# EAGLE schematic PCA9615_Connection (EAGLE 8.7.1)
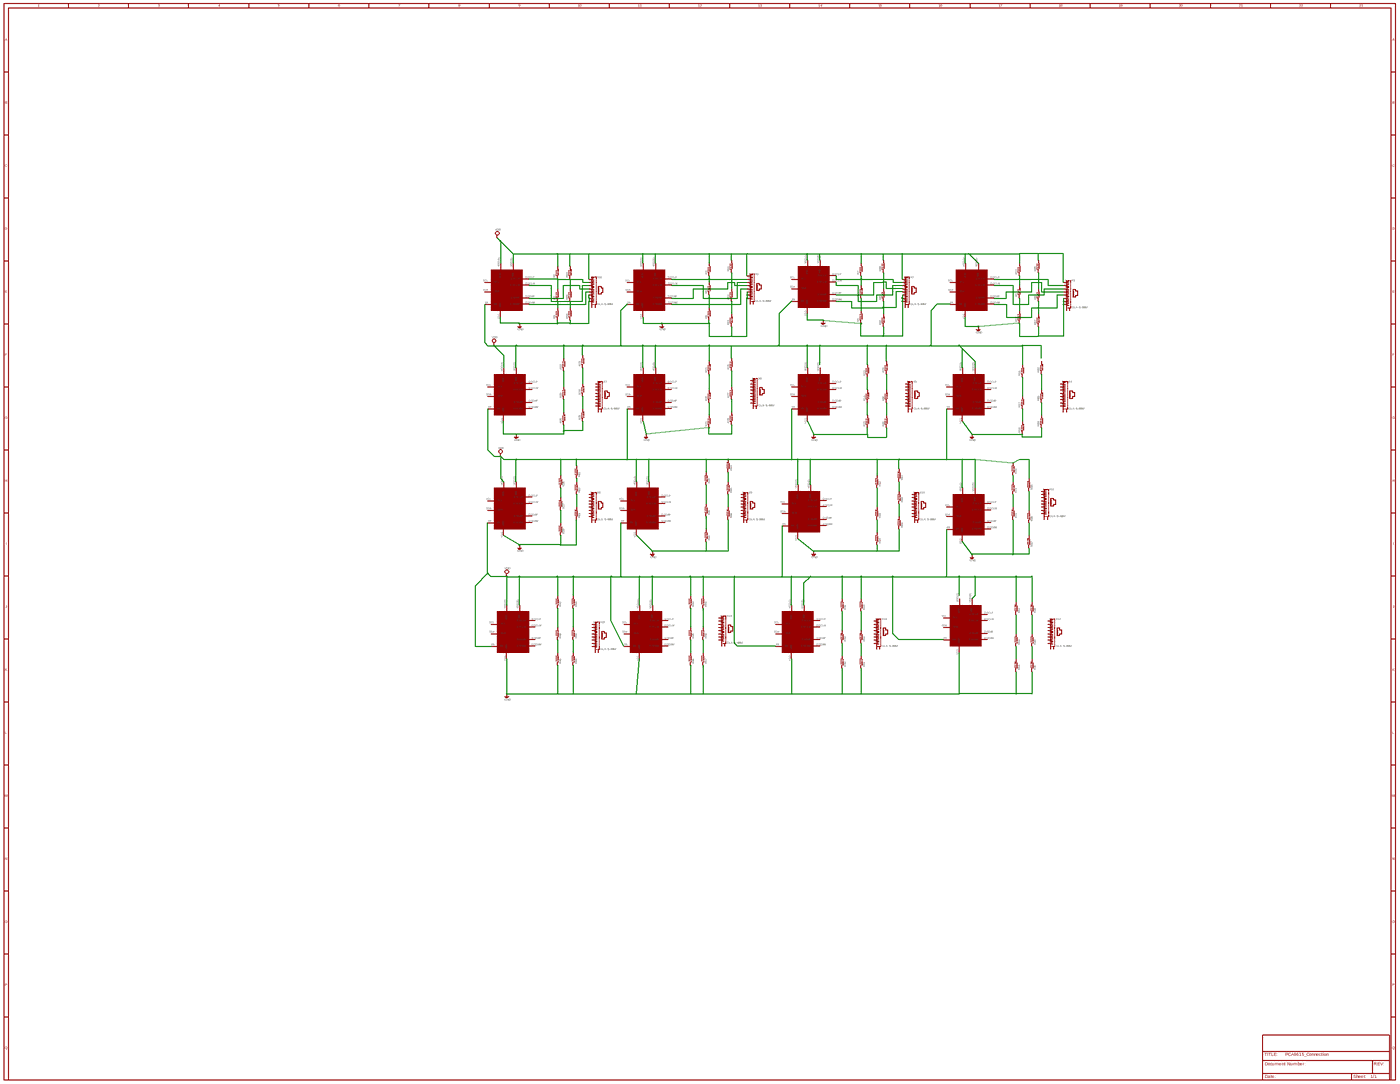
[diagram p0: schematic, sheet 1, overview]
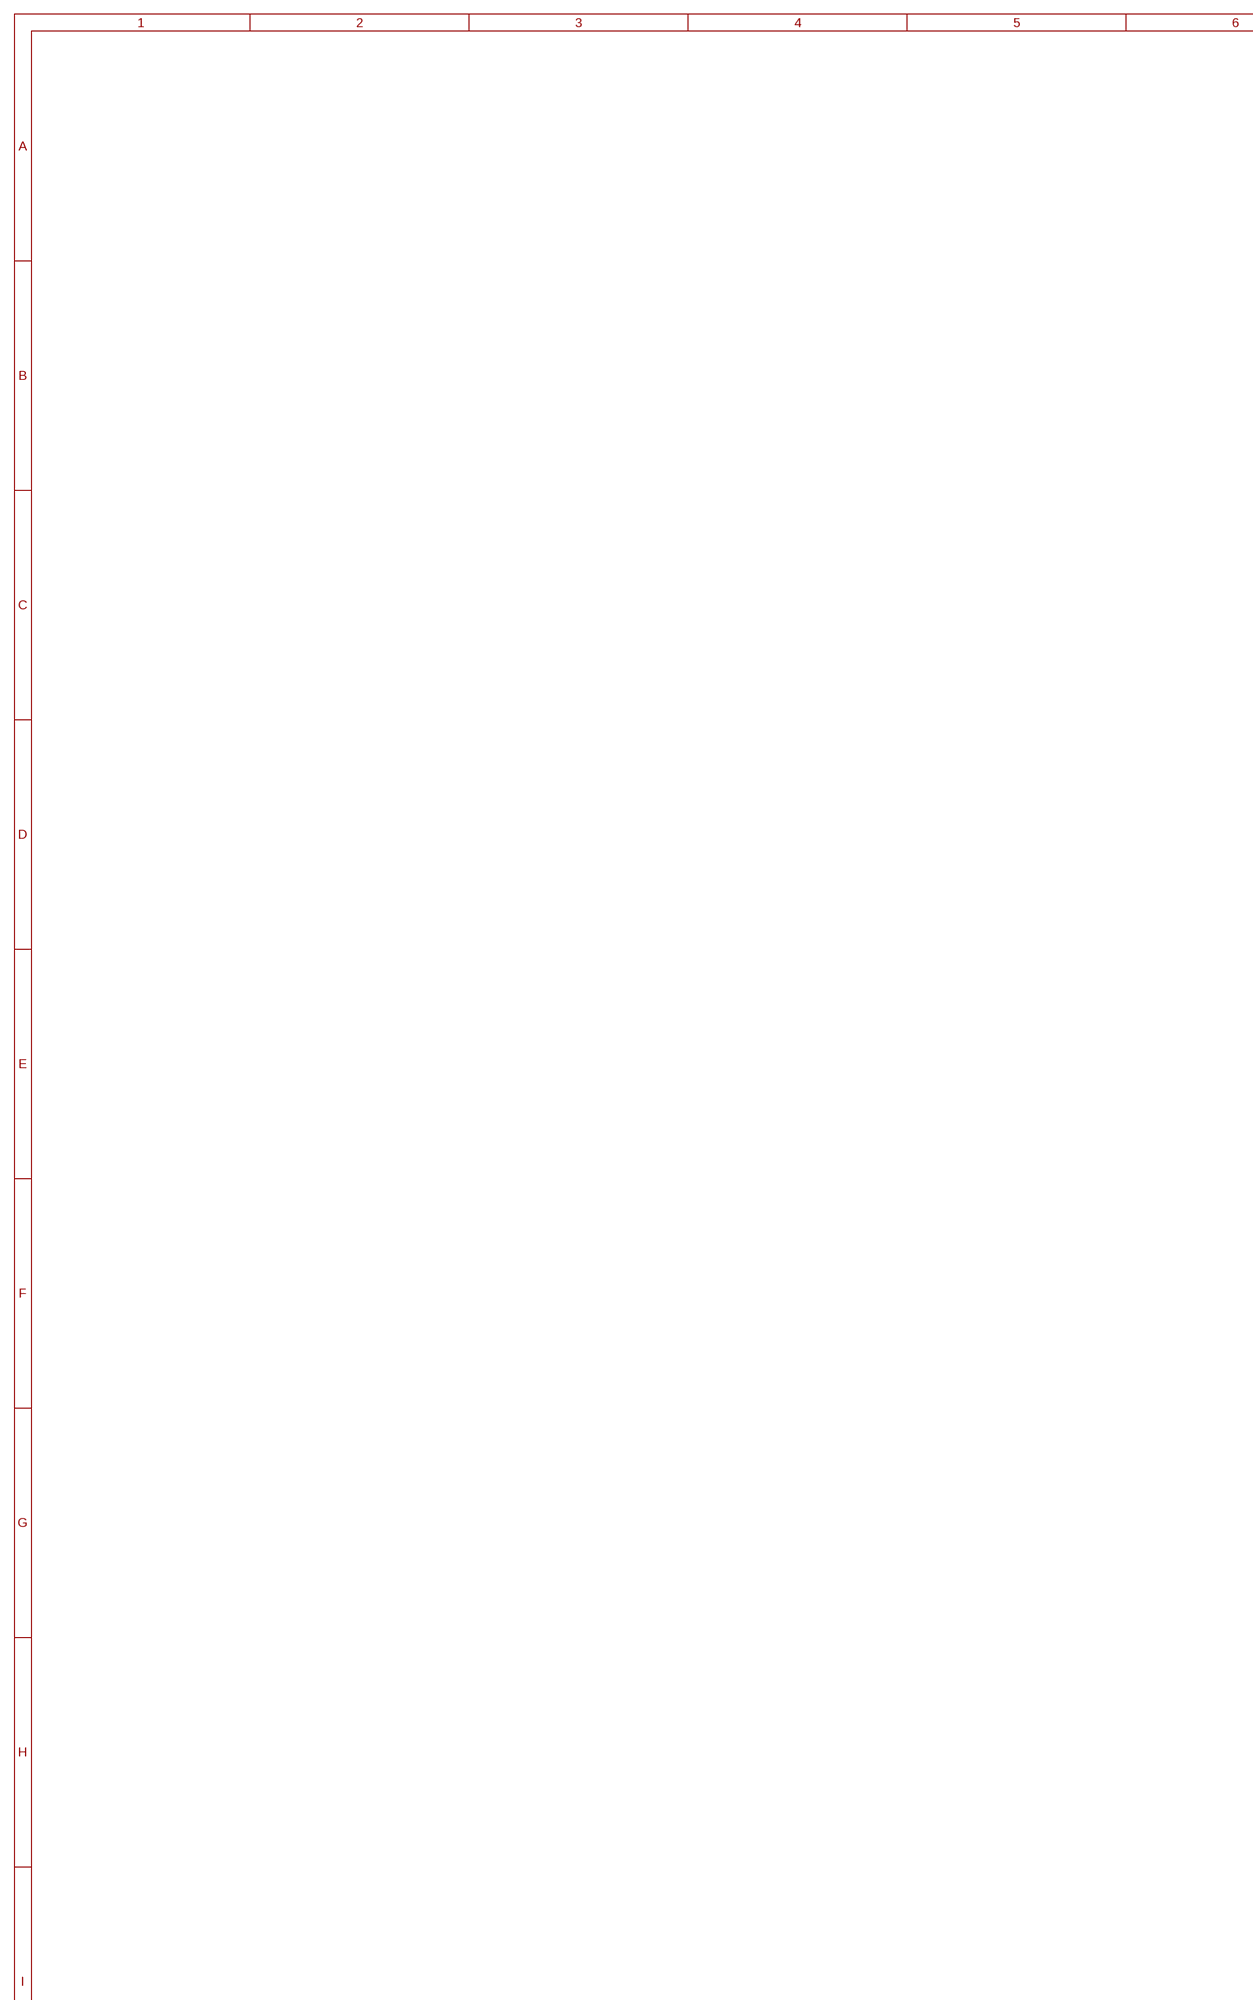
[diagram p1: schematic, sheet 1, part 1 of 8]
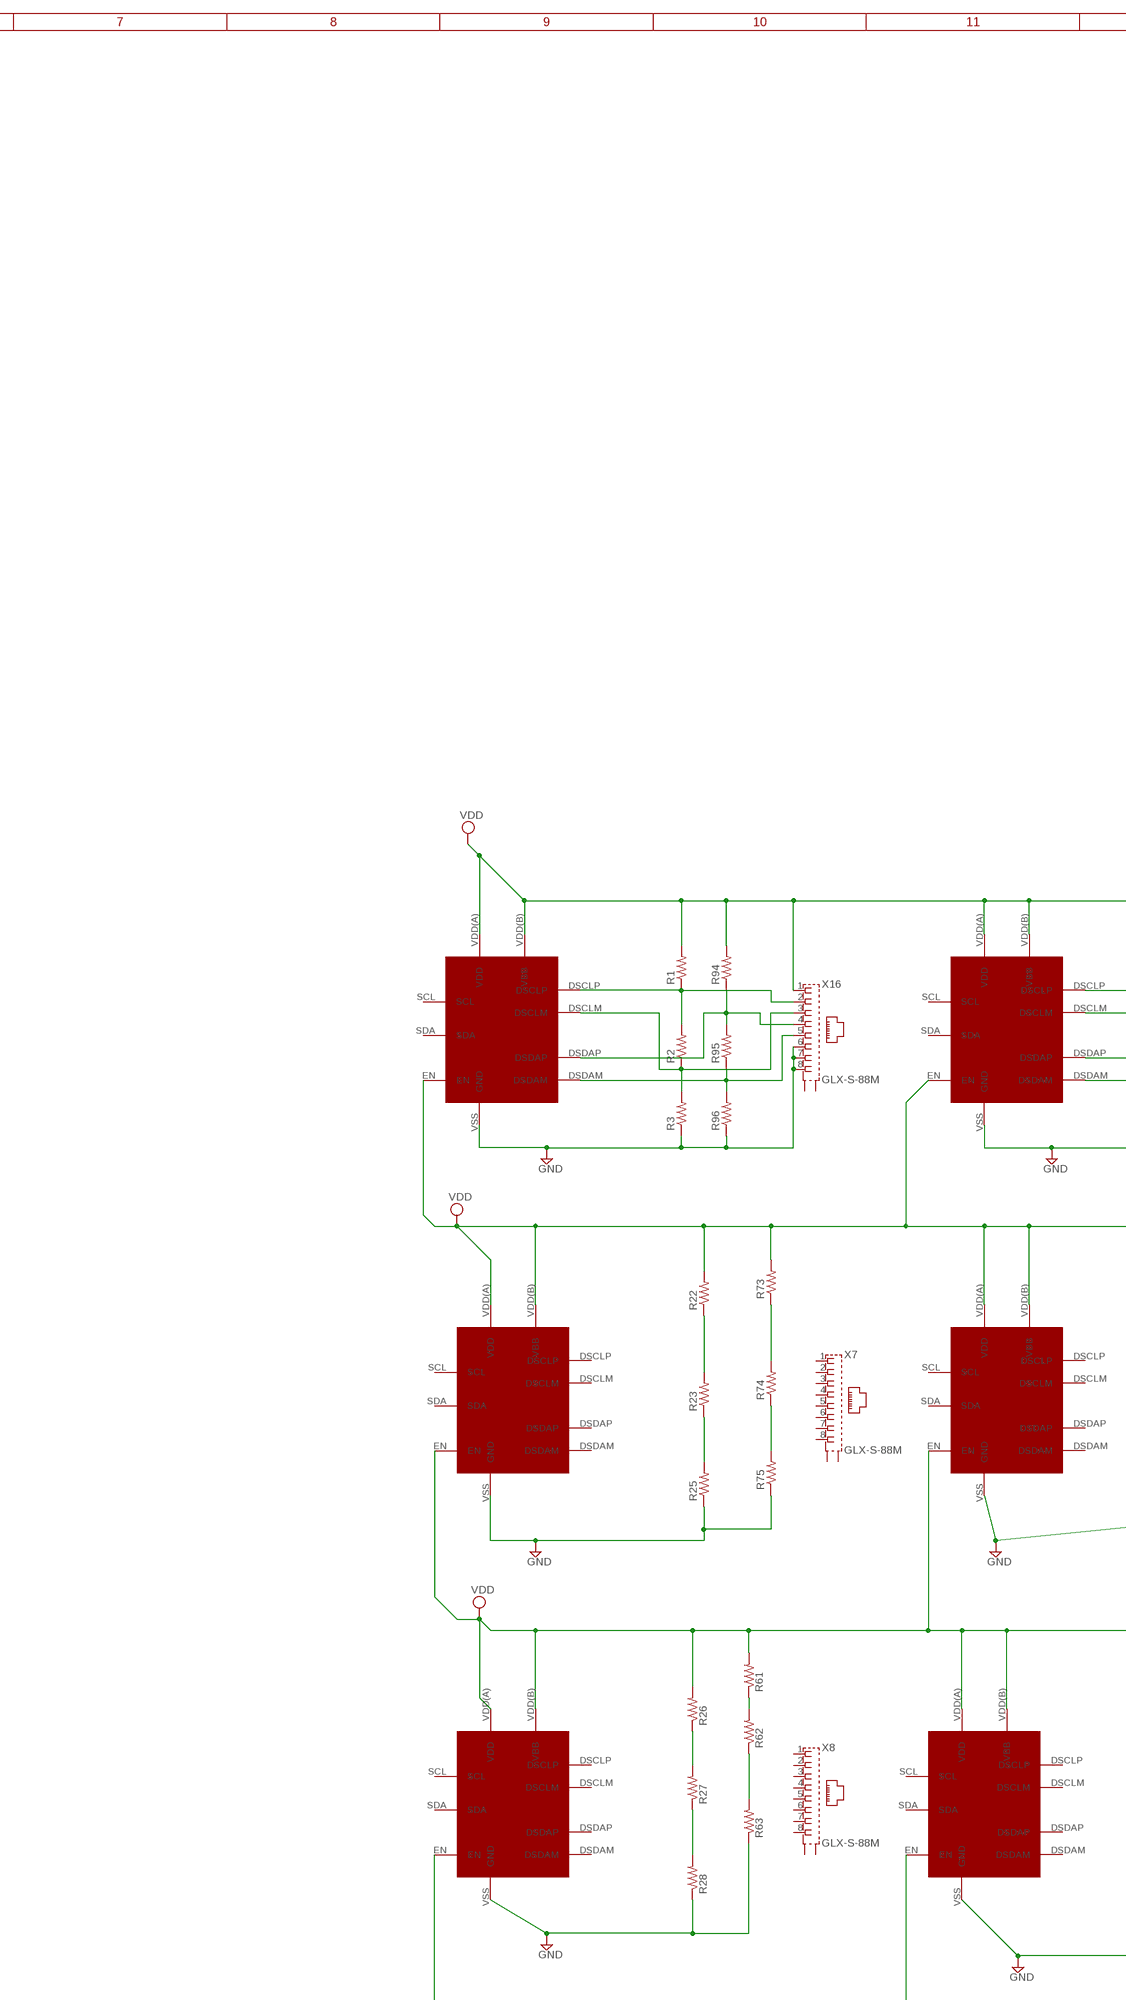
[diagram p2: schematic, sheet 1, part 2 of 8]
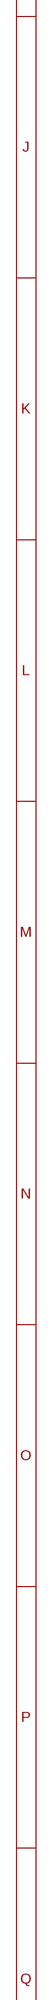
[diagram p3: schematic, sheet 1, part 3 of 8]
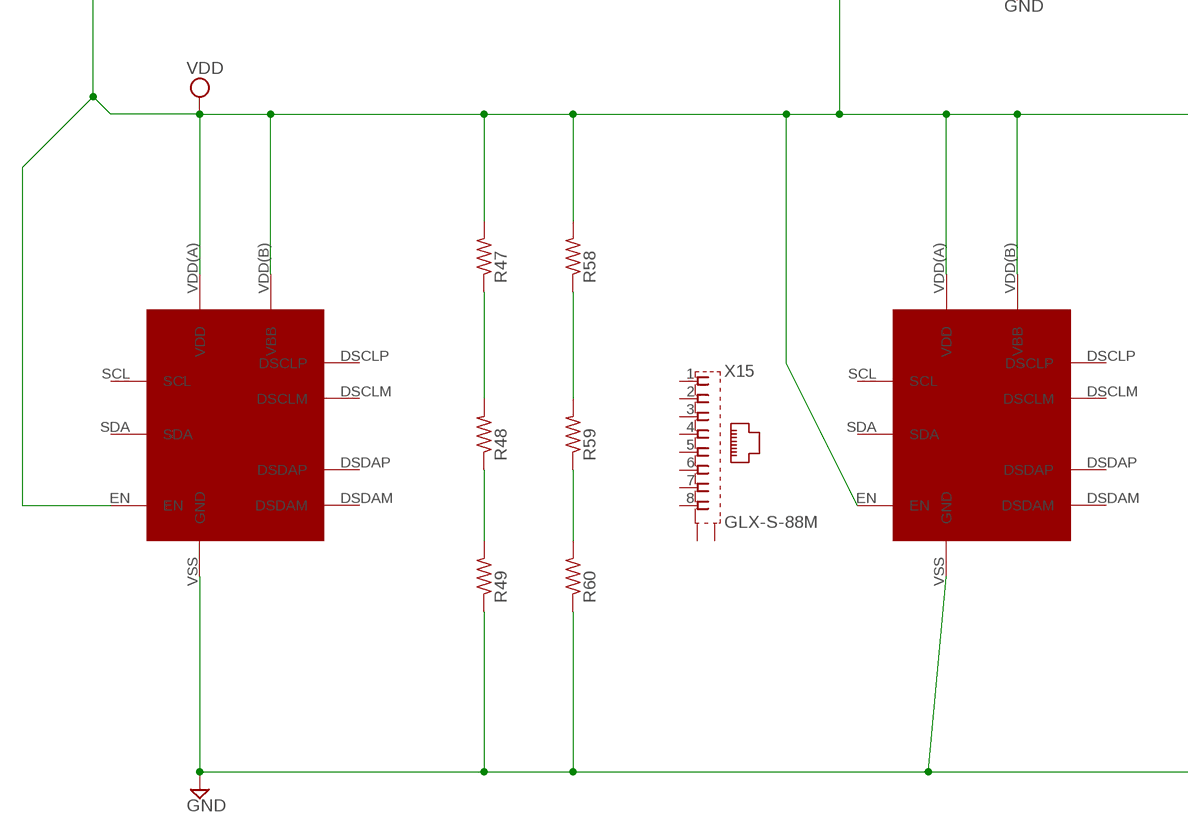
[diagram p4: schematic, sheet 1, part 4 of 8]
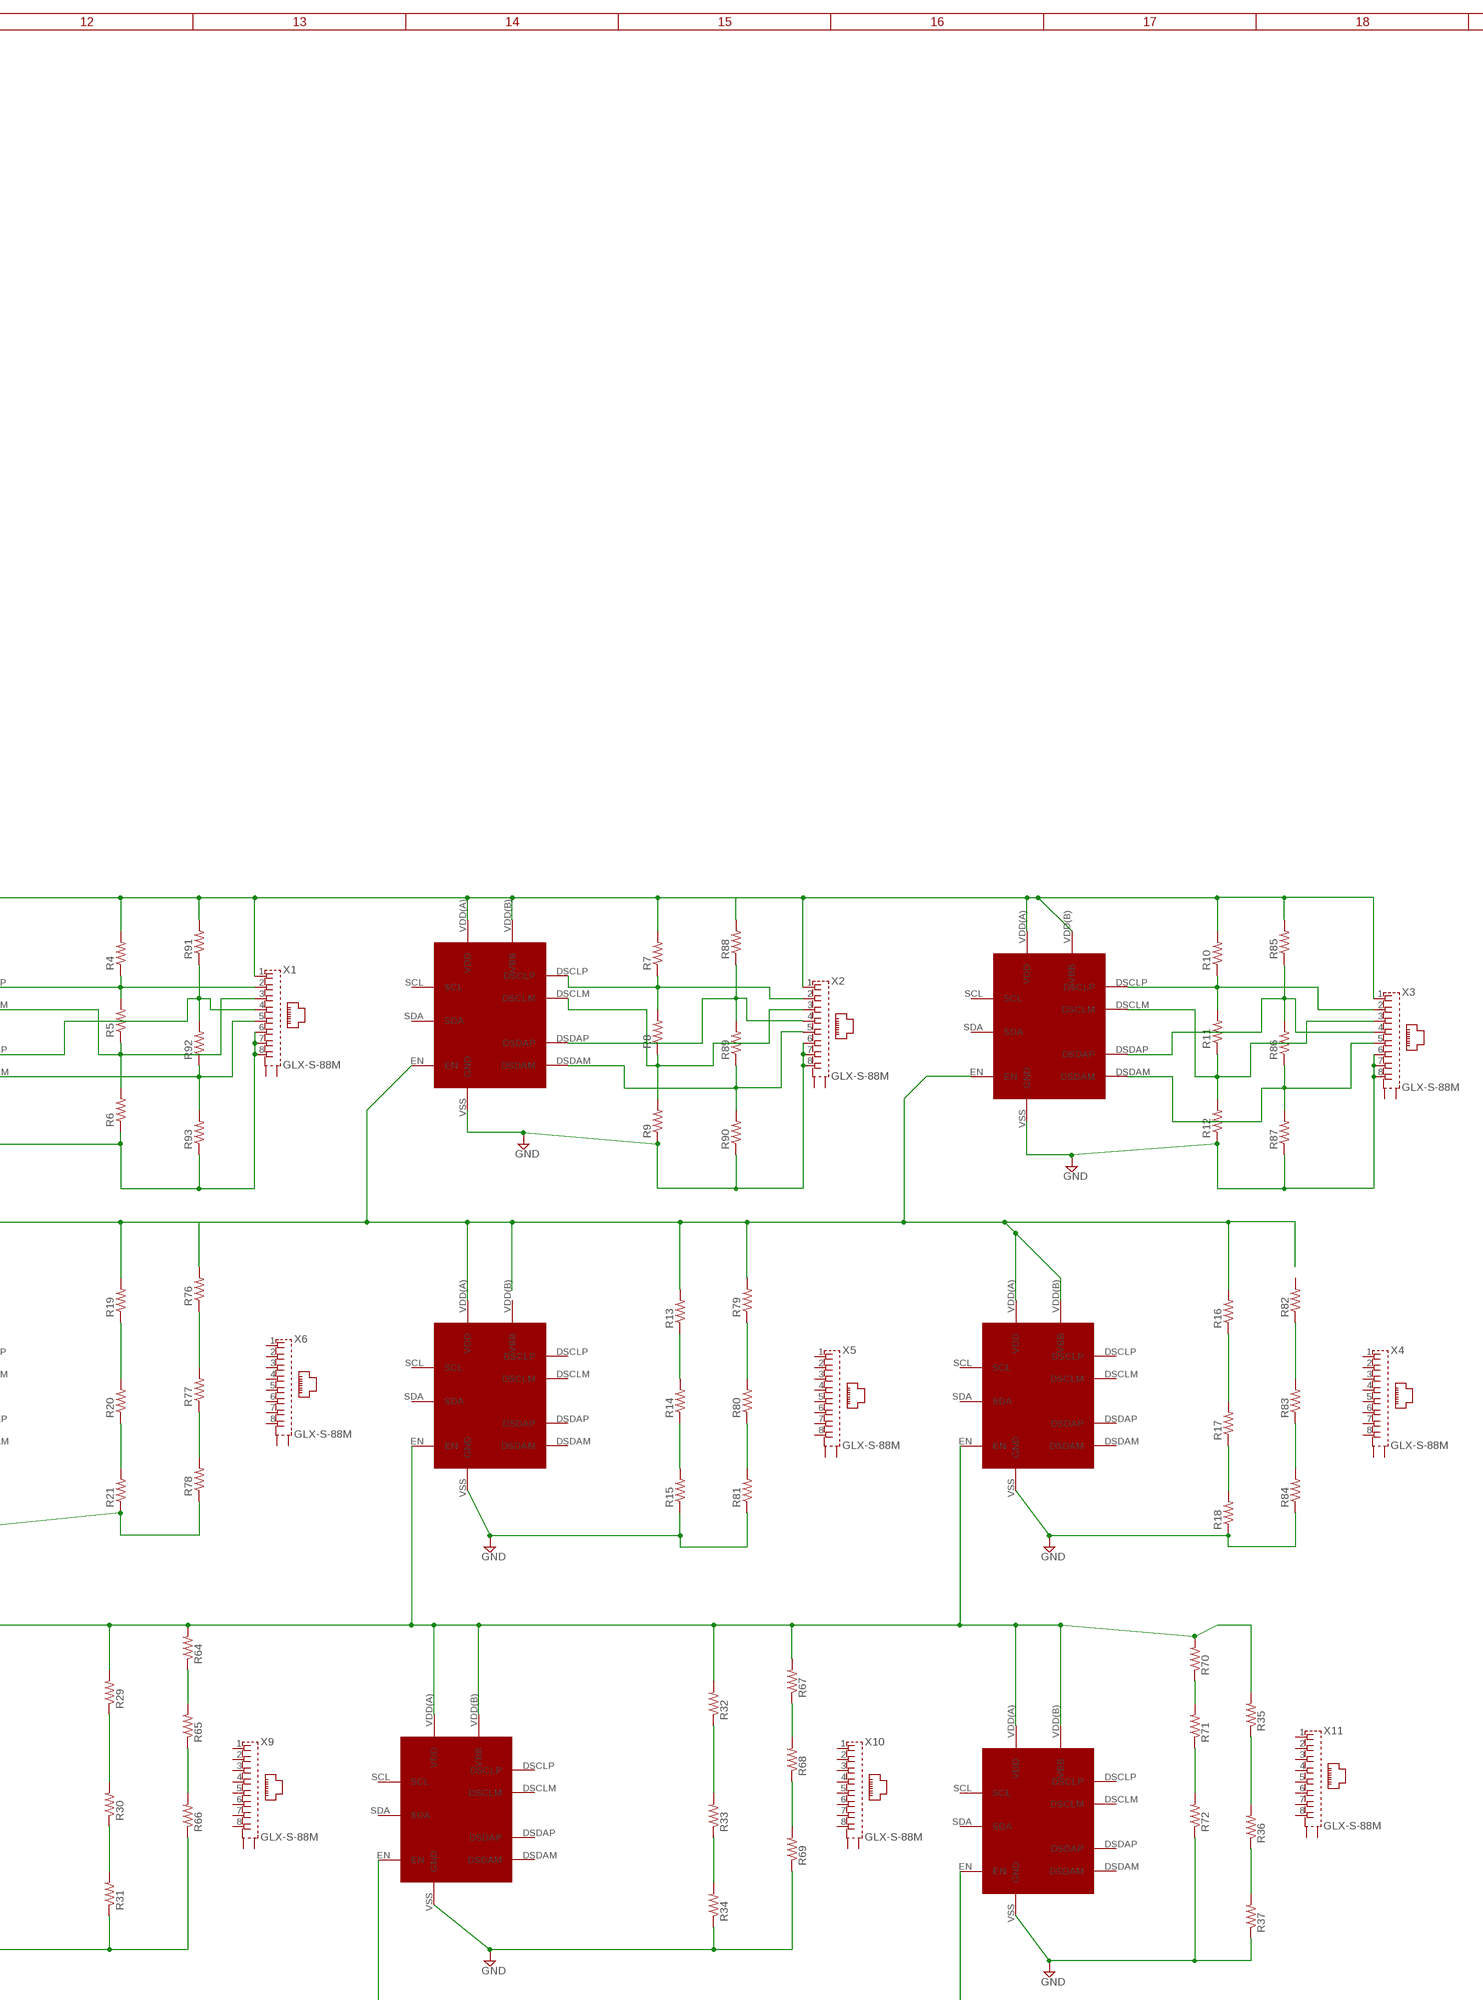
[diagram p5: schematic, sheet 1, part 5 of 8]
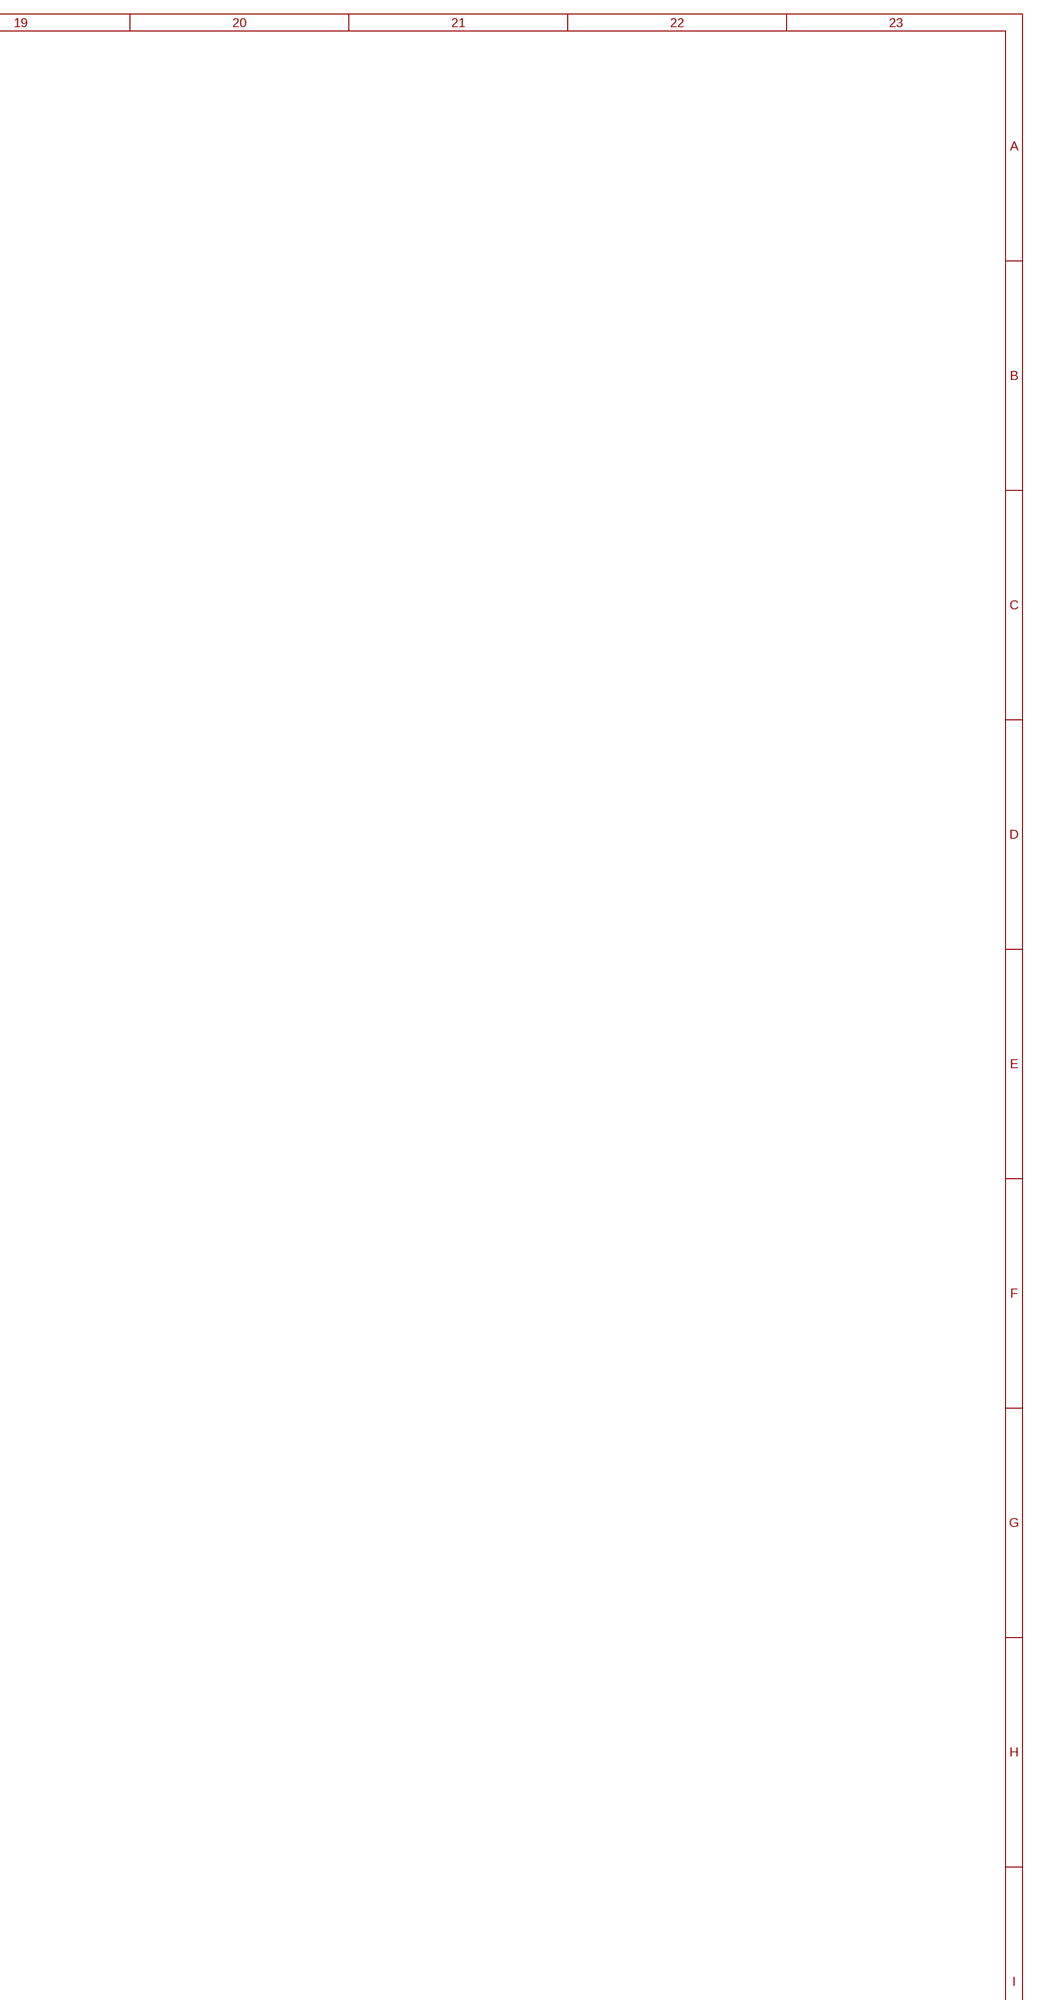
[diagram p6: schematic, sheet 1, part 6 of 8]
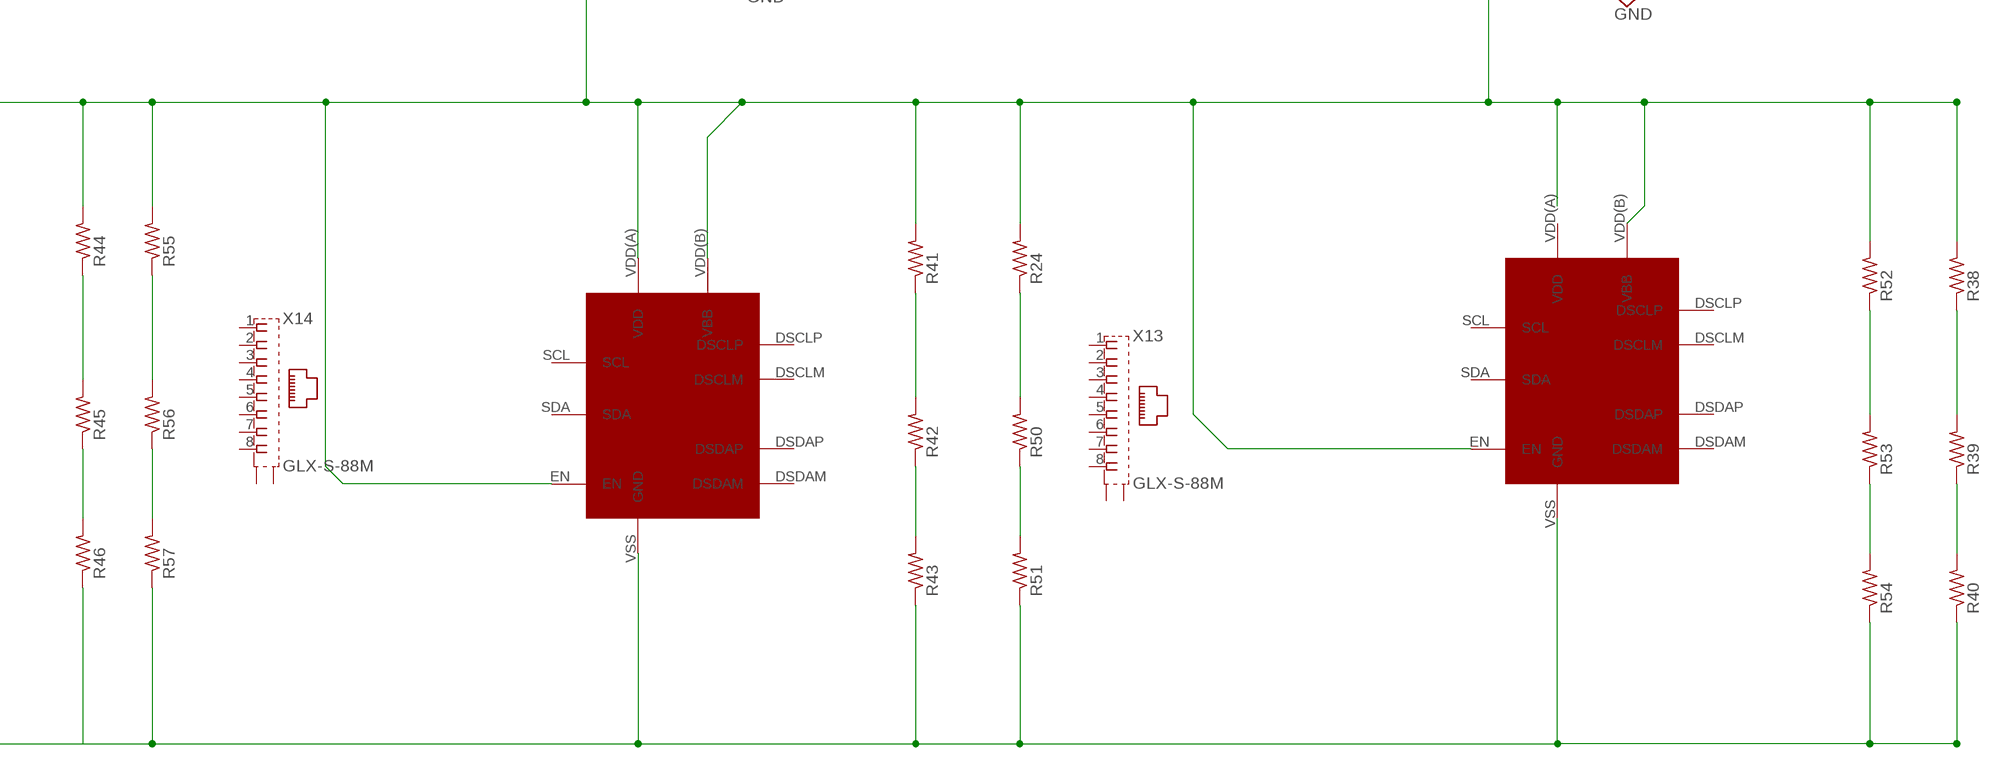
[diagram p7: schematic, sheet 1, part 7 of 8]
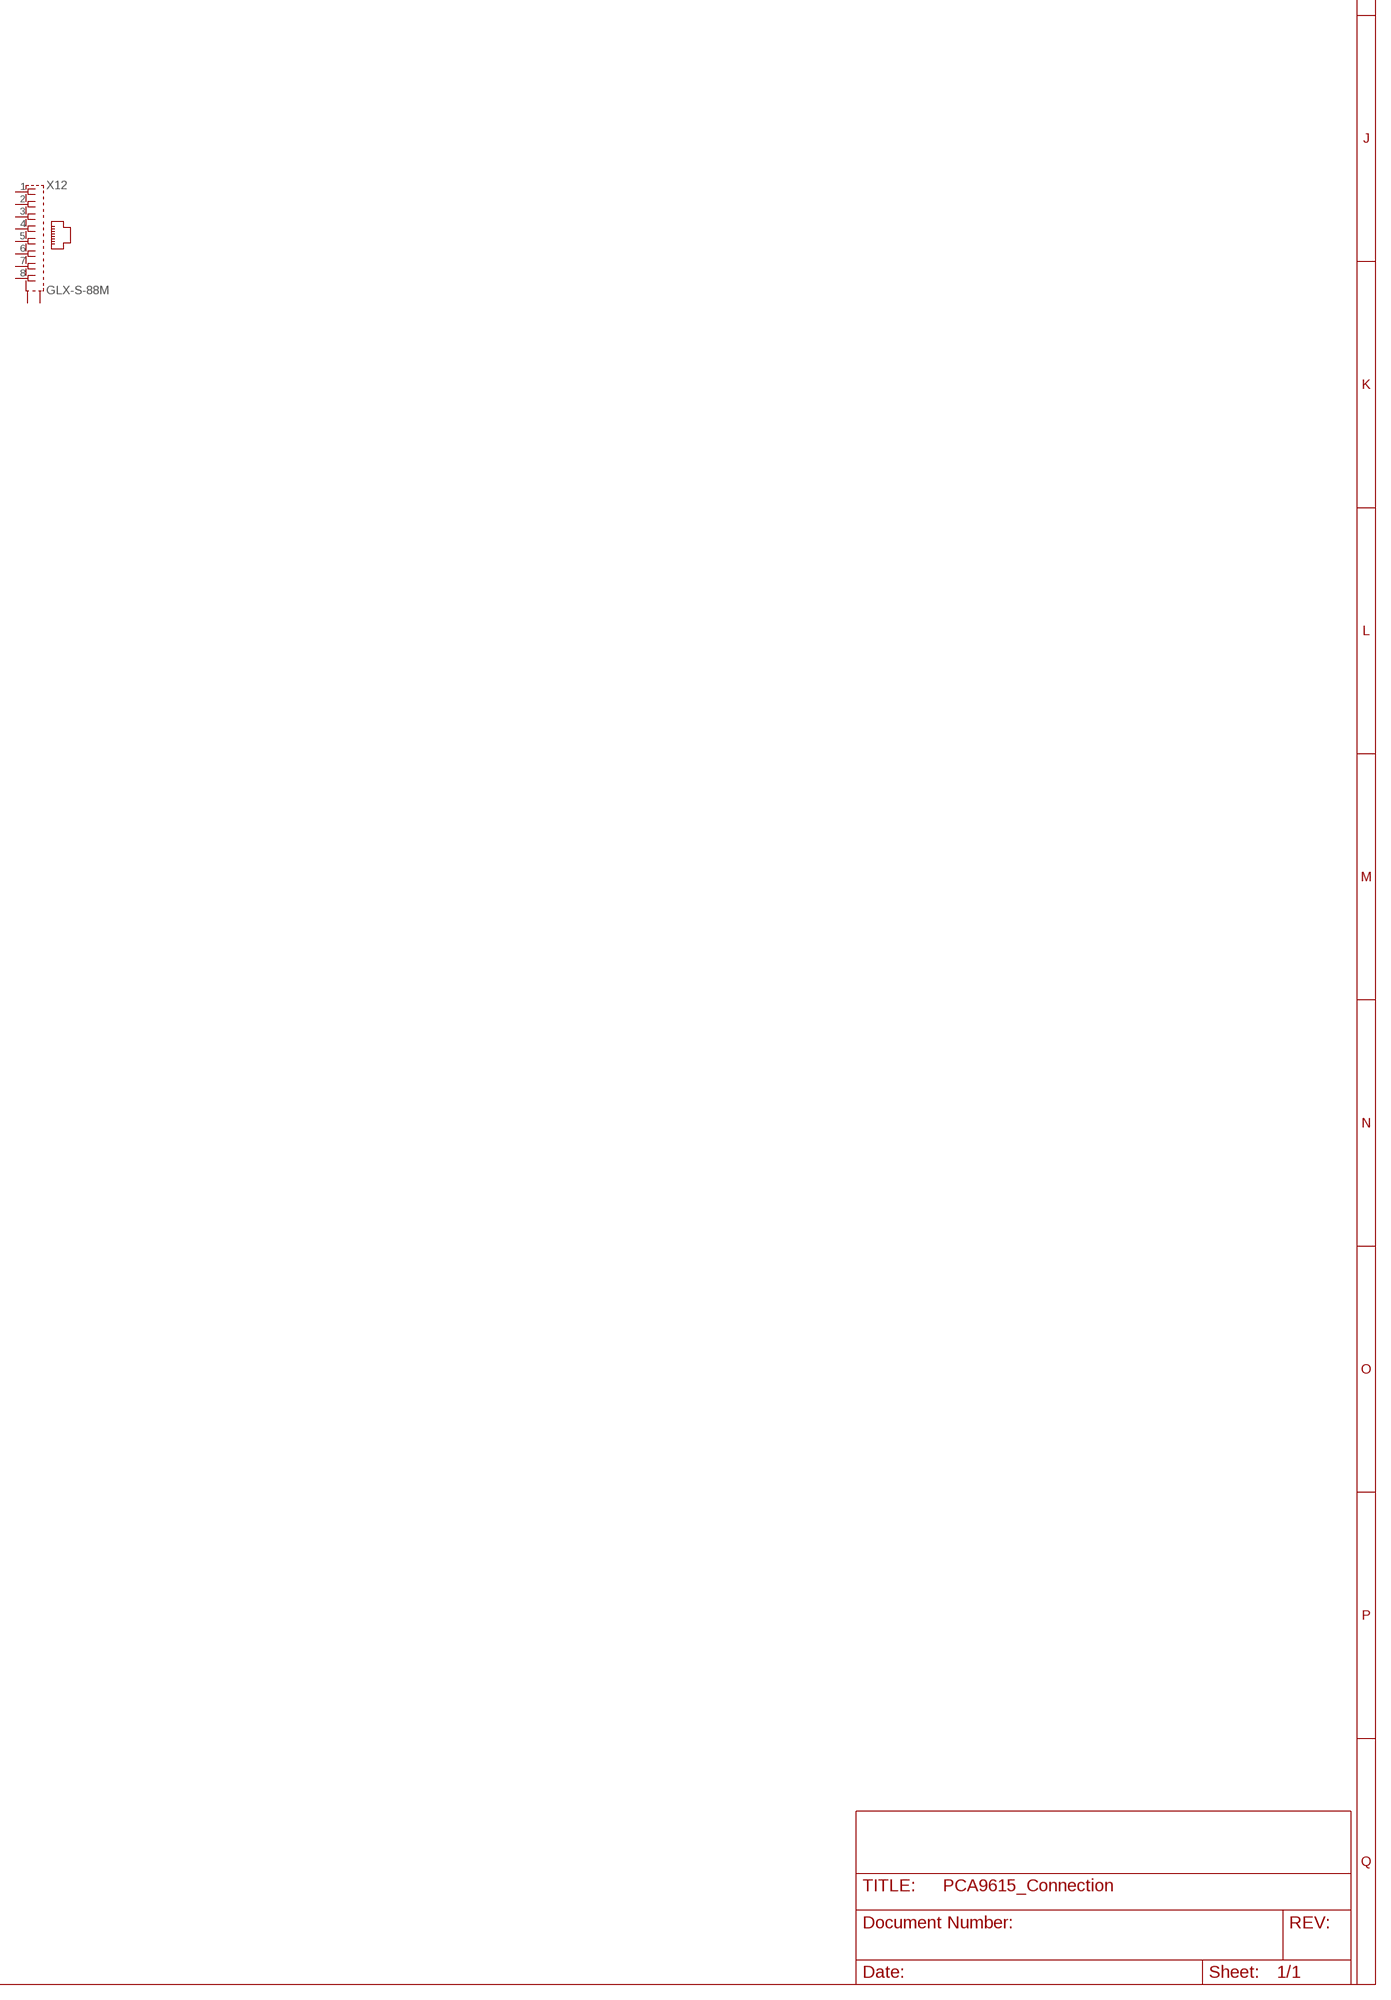
[diagram p8: schematic, sheet 1, part 8 of 8]

## Parts
R1  R-US_0204/7  [0204/7]
R2  R-US_0204/7  [0204/7]
R3  R-US_0204/7  [0204/7]
R4  R-US_0204/7  [0204/7]
R5  R-US_0204/7  [0204/7]
R6  R-US_0204/7  [0204/7]
R7  R-US_0204/7  [0204/7]
R8  R-US_0204/7  [0204/7]
R9  R-US_0204/7  [0204/7]
R10  R-US_0204/7  [0204/7]
R11  R-US_0204/7  [0204/7]
R12  R-US_0204/7  [0204/7]
R13  R-US_0204/7  [0204/7]
R14  R-US_0204/7  [0204/7]
R15  R-US_0204/7  [0204/7]
R16  R-US_0204/7  [0204/7]
R17  R-US_0204/7  [0204/7]
R18  R-US_0204/7  [0204/7]
R19  R-US_0204/7  [0204/7]
R20  R-US_0204/7  [0204/7]
R21  R-US_0204/7  [0204/7]
R22  R-US_0204/7  [0204/7]
R23  R-US_0204/7  [0204/7]
R24  R-US_0204/7  [0204/7]
R25  R-US_0204/7  [0204/7]
R26  R-US_0204/7  [0204/7]
R27  R-US_0204/7  [0204/7]
R28  R-US_0204/7  [0204/7]
R29  R-US_0204/7  [0204/7]
R30  R-US_0204/7  [0204/7]
R31  R-US_0204/7  [0204/7]
R32  R-US_0204/7  [0204/7]
R33  R-US_0204/7  [0204/7]
R34  R-US_0204/7  [0204/7]
R35  R-US_0204/7  [0204/7]
R36  R-US_0204/7  [0204/7]
R37  R-US_0204/7  [0204/7]
R38  R-US_0204/7  [0204/7]
R39  R-US_0204/7  [0204/7]
R40  R-US_0204/7  [0204/7]
R41  R-US_0204/7  [0204/7]
R42  R-US_0204/7  [0204/7]
R43  R-US_0204/7  [0204/7]
R44  R-US_0204/7  [0204/7]
R45  R-US_0204/7  [0204/7]
R46  R-US_0204/7  [0204/7]
R47  R-US_0204/7  [0204/7]
R48  R-US_0204/7  [0204/7]
R49  R-US_0204/7  [0204/7]
R50  R-US_0204/7  [0204/7]
R51  R-US_0204/7  [0204/7]
R52  R-US_0204/7  [0204/7]
R53  R-US_0204/7  [0204/7]
R54  R-US_0204/7  [0204/7]
R55  R-US_0204/7  [0204/7]
R56  R-US_0204/7  [0204/7]
R57  R-US_0204/7  [0204/7]
R58  R-US_0204/7  [0204/7]
R59  R-US_0204/7  [0204/7]
R60  R-US_0204/7  [0204/7]
R61  R-US_0204/7  [0204/7]
R62  R-US_0204/7  [0204/7]
R63  R-US_0204/7  [0204/7]
R64  R-US_0204/7  [0204/7]
R65  R-US_0204/7  [0204/7]
R66  R-US_0204/7  [0204/7]
R67  R-US_0204/7  [0204/7]
R68  R-US_0204/7  [0204/7]
R69  R-US_0204/7  [0204/7]
R70  R-US_0204/7  [0204/7]
R71  R-US_0204/7  [0204/7]
R72  R-US_0204/7  [0204/7]
R73  R-US_0204/7  [0204/7]
R74  R-US_0204/7  [0204/7]
R75  R-US_0204/7  [0204/7]
R76  R-US_0204/7  [0204/7]
R77  R-US_0204/7  [0204/7]
R78  R-US_0204/7  [0204/7]
R79  R-US_0204/7  [0204/7]
R80  R-US_0204/7  [0204/7]
R81  R-US_0204/7  [0204/7]
R82  R-US_0204/7  [0204/7]
R83  R-US_0204/7  [0204/7]
R84  R-US_0204/7  [0204/7]
R85  R-US_0204/7  [0204/7]
R86  R-US_0204/7  [0204/7]
R87  R-US_0204/7  [0204/7]
R88  R-US_0204/7  [0204/7]
R89  R-US_0204/7  [0204/7]
R90  R-US_0204/7  [0204/7]
R91  R-US_0204/7  [0204/7]
R92  R-US_0204/7  [0204/7]
R93  R-US_0204/7  [0204/7]
R94  R-US_0204/7  [0204/7]
R95  R-US_0204/7  [0204/7]
R96  R-US_0204/7  [0204/7]
U$1  PCA9615  [PCA9615]
U$2  PCA9615  [PCA9615]
U$3  PCA9615  [PCA9615]
U$4  PCA9615  [PCA9615]
U$5  PCA9615  [PCA9615]
U$6  PCA9615  [PCA9615]
U$7  PCA9615  [PCA9615]
U$8  PCA9615  [PCA9615]
U$9  PCA9615  [PCA9615]
U$10  PCA9615  [PCA9615]
U$11  PCA9615  [PCA9615]
U$12  PCA9615  [PCA9615]
U$13  PCA9615  [PCA9615]
U$14  PCA9615  [PCA9615]
U$15  PCA9615  [PCA9615]
U$16  PCA9615  [PCA9615]
X1  GLX-S-88M  [GLX-S-88M]
X2  GLX-S-88M  [GLX-S-88M]
X3  GLX-S-88M  [GLX-S-88M]
X4  GLX-S-88M  [GLX-S-88M]
X5  GLX-S-88M  [GLX-S-88M]
X6  GLX-S-88M  [GLX-S-88M]
X7  GLX-S-88M  [GLX-S-88M]
X8  GLX-S-88M  [GLX-S-88M]
X9  GLX-S-88M  [GLX-S-88M]
X10  GLX-S-88M  [GLX-S-88M]
X11  GLX-S-88M  [GLX-S-88M]
X12  GLX-S-88M  [GLX-S-88M]
X13  GLX-S-88M  [GLX-S-88M]
X14  GLX-S-88M  [GLX-S-88M]
X15  GLX-S-88M  [GLX-S-88M]
X16  GLX-S-88M  [GLX-S-88M]

## Nets
GND [GND]: R3.1 R6.1 R9.1 R12.1 R15.1 R18.1 R21.1 R25.1 R28.1 R31.1 R34.1 R37.1 R40.1 R43.1 R46.1 R49.1 R51.1 R54.1 R57.1 R60.1 R63.1 R66.1 R69.1 R72.1 R75.1 R78.1 R81.1 R84.1 R87.1 R90.1 R93.1 R96.1 U$1.VSS(GND) U$2.VSS(GND) U$3.VSS(GND) U$4.VSS(GND) U$5.VSS(GND) U$6.VSS(GND) U$7.VSS(GND) U$8.VSS(GND) U$9.VSS(GND) U$10.VSS(GND) U$11.VSS(GND) U$12.VSS(GND) U$13.VSS(GND) U$14.VSS(GND) U$15.VSS(GND) U$16.VSS(GND) X1.6 X1.7 X1.8 X2.6 X2.7 X2.8 X3.6 X3.7 X3.8 X16.6 X16.7 X16.8
N$1 [GND]: R1.1 R2.2 U$10.DSCLP X16.2
N$2 [GND]: R2.1 R3.2 U$10.DSCLM X16.3
N$4 [GND]: R47.1 R48.2
N$5 [GND]: R5.1 R6.2 U$11.DSCLM X1.3
N$6 [GND]: R7.1 R8.2 U$16.DSCLP X2.2
N$7 [GND]: R8.1 R9.2 U$16.DSCLM X2.3
N$8 [GND]: R10.1 R11.2 U$15.DSCLP X3.2
N$9 [GND]: R11.1 R12.2 U$15.DSCLM X3.3
N$10 [GND]: R22.1 R23.2
N$11 [GND]: R23.1 R25.2
N$12 [GND]: R35.1 R36.2
N$13 [GND]: R19.1 R20.2
N$14 [GND]: R20.1 R21.2
N$15 [GND]: R14.1 R15.2
N$16 [GND]: R13.1 R14.2
N$17 [GND]: R16.1 R17.2
N$18 [GND]: R17.1 R18.2
N$19 [GND]: R36.1 R37.2
N$20 [GND]: R32.1 R33.2
N$21 [GND]: R33.1 R34.2
N$22 [GND]: R29.1 R30.2
N$23 [GND]: R30.1 R31.2
N$24 [GND]: R26.1 R27.2
N$25 [GND]: R27.1 R28.2
N$26 [GND]: R48.1 R49.2
N$27 [GND]: R44.1 R45.2
N$28 [GND]: R45.1 R46.2
N$29 [GND]: R41.1 R42.2
N$30 [GND]: R42.1 R43.2
N$31 [GND]: R38.1 R39.2
N$32 [GND]: R39.1 R40.2
N$33 [GND]: R24.1 R50.2
N$34 [GND]: R50.1 R51.2
N$35 [GND]: R52.1 R53.2
N$36 [GND]: R53.1 R54.2
N$37 [GND]: R55.1 R56.2
N$38 [GND]: R56.1 R57.2
N$39 [GND]: R58.1 R59.2
N$40 [GND]: R59.1 R60.2
N$41 [GND]: R61.1 R62.2
N$42 [GND]: R62.1 R63.2
N$43 [GND]: R64.1 R65.2
N$44 [GND]: R65.1 R66.2
N$45 [GND]: R67.1 R68.2
N$46 [GND]: R68.1 R69.2
N$47 [GND]: R70.1 R71.2
N$48 [GND]: R71.1 R72.2
N$49 [GND]: R73.1 R74.2
N$50 [GND]: R74.1 R75.2
N$51 [GND]: R76.1 R77.2
N$52 [GND]: R77.1 R78.2
N$53 [GND]: R79.1 R80.2
N$54 [GND]: R80.1 R81.2
N$55 [GND]: R82.1 R83.2
N$56 [GND]: R83.1 R84.2
N$57 [GND]: R85.1 R86.2 U$15.DSDAP X3.4
N$58 [GND]: R86.1 R87.2 U$15.DSDAM X3.5
N$59 [GND]: R88.1 R89.2 U$16.DSDAP X2.4
N$60 [GND]: R89.1 R90.2 U$16.DSDAM X2.5
N$61 [GND]: R91.1 R92.2 U$11.DSDAP X1.4
N$62 [GND]: R92.1 R93.2 U$11.DSDAM X1.5
N$63 [GND]: R94.1 R95.2 U$10.DSDAP X16.4
N$64 [GND]: R95.1 R96.2 U$10.DSDAM X16.5
N$67 [GND]: R4.1 R5.2 U$11.DSCLP X1.2
VDD: R1.2 R4.2 R7.2 R10.2 R13.2 R16.2 R19.2 R22.2 R24.2 R26.2 R29.2 R32.2 R35.2 R38.2 R41.2 R44.2 R47.2 R52.2 R55.2 R58.2 R61.2 R64.2 R67.2 R70.2 R73.2 R76.2 R79.2 R85.2 R88.2 R91.2 R94.2 U$1.EN U$1.VDD(A)(VDD) U$1.VDD(B)(VBB) U$2.EN U$2.VDD(A)(VDD) U$3.EN U$3.VDD(A)(VDD) U$3.VDD(B)(VBB) U$4.EN U$4.VDD(A)(VDD) U$4.VDD(B)(VBB) U$5.EN U$5.VDD(A)(VDD) U$5.VDD(B)(VBB) U$6.EN U$6.VDD(A)(VDD) U$6.VDD(B)(VBB) U$7.EN U$7.VDD(A)(VDD) U$7.VDD(B)(VBB) U$8.EN U$8.VDD(A)(VDD) U$8.VDD(B)(VBB) U$9.EN U$9.VDD(A)(VDD) U$9.VDD(B)(VBB) U$10.EN U$10.VDD(A)(VDD) U$10.VDD(B)(VBB) U$11.EN U$11.VDD(A)(VDD) U$11.VDD(B)(VBB) U$12.EN U$12.VDD(A)(VDD) U$12.VDD(B)(VBB) U$13.EN U$13.VDD(A)(VDD) U$13.VDD(B)(VBB) U$14.EN U$14.VDD(B)(VBB) U$15.EN U$15.VDD(A)(VDD) U$15.VDD(B)(VBB) U$16.EN U$16.VDD(A)(VDD) U$16.VDD(B)(VBB) X1.1 X2.1 X3.1 X16.1
Unconnected: R82.2 U$1.DSCLM U$1.DSCLP U$1.DSDAM U$1.DSDAP U$1.SCL U$1.SDA U$2.DSCLM U$2.DSCLP U$2.DSDAM U$2.DSDAP U$2.SCL U$2.SDA U$2.VDD(B)(VBB) U$3.DSCLM U$3.DSCLP U$3.DSDAM U$3.DSDAP U$3.SCL U$3.SDA U$4.DSCLM U$4.DSCLP U$4.DSDAM U$4.DSDAP U$4.SCL U$4.SDA U$5.DSCLM U$5.DSCLP U$5.DSDAM U$5.DSDAP U$5.SCL U$5.SDA U$6.DSCLM U$6.DSCLP U$6.DSDAM U$6.DSDAP U$6.SCL U$6.SDA U$7.DSCLM U$7.DSCLP U$7.DSDAM U$7.DSDAP U$7.SCL U$7.SDA U$8.DSCLM U$8.DSCLP U$8.DSDAM U$8.DSDAP U$8.SCL U$8.SDA U$9.DSCLM U$9.DSCLP U$9.DSDAM U$9.DSDAP U$9.SCL U$9.SDA U$10.SCL U$10.SDA U$11.SCL U$11.SDA U$12.DSCLM U$12.DSCLP U$12.DSDAM U$12.DSDAP U$12.SCL U$12.SDA U$13.DSCLM U$13.DSCLP U$13.DSDAM U$13.DSDAP U$13.SCL U$13.SDA U$14.DSCLM U$14.DSCLP U$14.DSDAM U$14.DSDAP U$14.SCL U$14.SDA U$14.VDD(A)(VDD) U$15.SCL U$15.SDA U$16.SCL U$16.SDA X1.S1 X1.S2 X2.S1 X2.S2 X3.S1 X3.S2 X4.1 X4.2 X4.3 X4.4 X4.5 X4.6 X4.7 X4.8 X4.S1 X4.S2 X5.1 X5.2 X5.3 X5.4 X5.5 X5.6 X5.7 X5.8 X5.S1 X5.S2 X6.1 X6.2 X6.3 X6.4 X6.5 X6.6 X6.7 X6.8 X6.S1 X6.S2 X7.1 X7.2 X7.3 X7.4 X7.5 X7.6 X7.7 X7.8 X7.S1 X7.S2 X8.1 X8.2 X8.3 X8.4 X8.5 X8.6 X8.7 X8.8 X8.S1 X8.S2 X9.1 X9.2 X9.3 X9.4 X9.5 X9.6 X9.7 X9.8 X9.S1 X9.S2 X10.1 X10.2 X10.3 X10.4 X10.5 X10.6 X10.7 X10.8 X10.S1 X10.S2 X11.1 X11.2 X11.3 X11.4 X11.5 X11.6 X11.7 X11.8 X11.S1 X11.S2 X12.1 X12.2 X12.3 X12.4 X12.5 X12.6 X12.7 X12.8 X12.S1 X12.S2 X13.1 X13.2 X13.3 X13.4 X13.5 X13.6 X13.7 X13.8 X13.S1 X13.S2 X14.1 X14.2 X14.3 X14.4 X14.5 X14.6 X14.7 X14.8 X14.S1 X14.S2 X15.1 X15.2 X15.3 X15.4 X15.5 X15.6 X15.7 X15.8 X15.S1 X15.S2 X16.S1 X16.S2

## Library data of the parts
R1-R96 = resistor:R-US_: RESISTOR, American symbol
U$1-U$16 = PCA9615:PCA9615
X1-X16 = con-kycon:GLX-S-88M: Mod. Jack, Right Angle, 8 posiotion, 8 contatcs RJ45 Source: GLX-S-88M.pdf; OC_FARNELL: unknown; OC_NEWARK: unknown